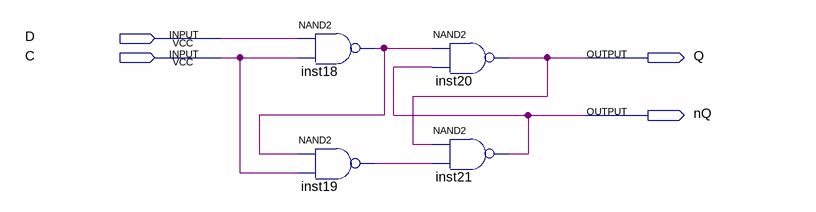
[diagram p0: schematic sheet]
// Quartus schematic DTrig.bdf as structural Verilog: 4 symbols, 4 pins
module DTrig (
  input  D,
  input  C,
  output Q,
  output nQ
);

  wire inst18_out, inst19_out;

  nand inst18 (inst18_out, D, C);
  nand inst19 (inst19_out, inst18_out, C);
  nand inst20 (Q, inst18_out, nQ);
  nand inst21 (nQ, Q, inst19_out);
endmodule
